# Altium schematic sheet Overvoltage_Protection.SchDoc: Overvoltage Protection
size A3; DocumentNumber: 7; SheetNumber: 7; SheetTotal: 20
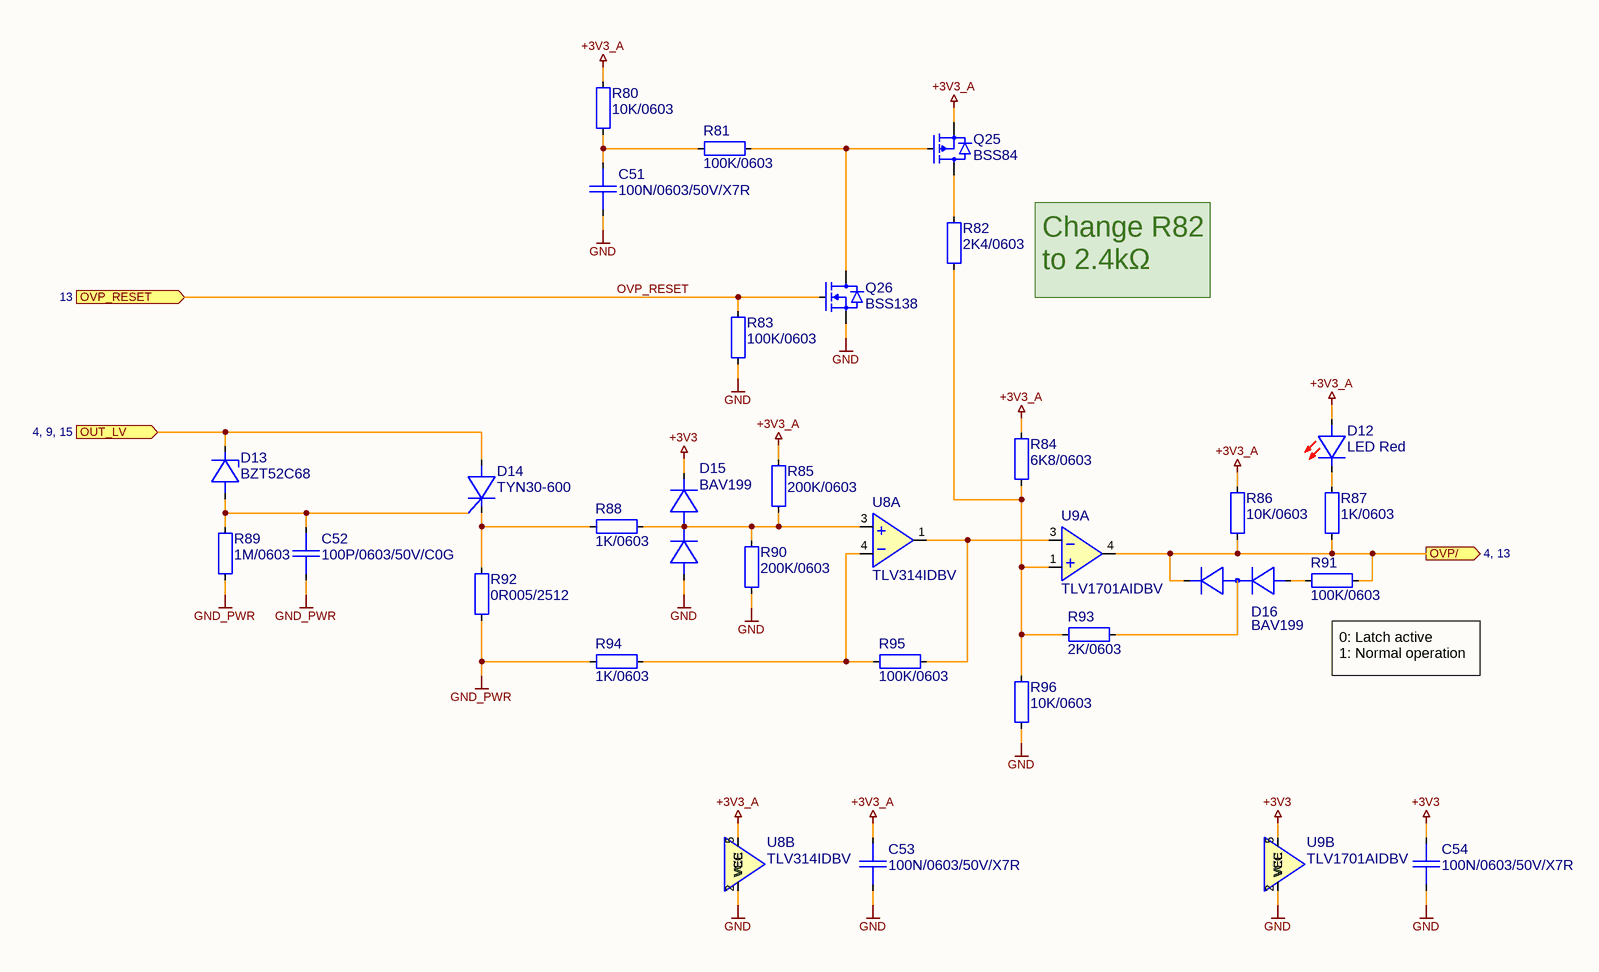
[diagram p0: Overvoltage_Protection.SchDoc]

## Parts
C51  100N/0603/50V/X7R  [CAP0603_X7R]
C52  100P/0603/50V/C0G  [CAP0603_C0G]
C53  100N/0603/50V/X7R  [CAP0603_X7R]
C54  100N/0603/50V/X7R  [CAP0603_X7R]
D12  LED Red  [LED0805_RED]
D13  BZT52C68  [SOD3718X125]
D14  TYN30-600  [TO220-3]
D15  BAV199  [SOT2395P280X125-3-SE]
D16  BAV199  [SOT2395P280X125-3-SE]
Q25  BSS84  [SOT2395P280X125-3-SE]
Q26  BSS138  [SOT2395P280X125-3-SE]
R80  10K/0603  [R0603-0.40-WW]
R81  100K/0603  [R0603-0.40-WW]
R82  2K4/0603  [R0603-0.40-WW]
R83  100K/0603  [R0603-0.40-WW]
R84  6K8/0603  [R0603-0.40-WW]
R85  200K/0603  [R0603-0.40-WW]
R86  10K/0603  [R0603-0.40-WW]
R87  1K/0603  [R0603-0.40-WW]
R88  1K/0603  [R0603-0.40-WW]
R89  1M/0603  [R0603-0.40-WW]
R90  200K/0603  [R0603-0.40-WW]
R91  100K/0603  [R0603-0.40-WW]
R92  0R005/2512  [R2512-0.65-WW]
R93  2K/0603  [R0603-0.40-WW]
R94  1K/0603  [R0603-0.40-WW]
R95  100K/0603  [R0603-0.40-WW]
R96  10K/0603  [R0603-0.40-WW]
U8  TLV314IDBV  [SOT2395P280X125-5-NW]  (parts A,B of 2)
U9  TLV1701AIDBV  [SOT2395P280X125-5-NW]  (parts A,B of 2)

## Ports
OUT_LV (in, see 4, 9, 15), OVP/ (out, see 4, 13), OVP_RESET (in, see 13)

## Nets
+3V3: C54.1 D15.2(K2) U9.5(VCC)
+3V3_A: C53.1 D12.2(A) Q25.2(SOURCE) R80.1 R84.1 R85.1 R86.2 U8.5(VCC)
GND: C51.2 C53.2 C54.2 D15.1(A1) Q26.2(SOURCE) R83.2 R90.2 R96.2 U8.2(VEE) U9.2(VEE)
GND_PWR: C52.2 R89.2 R92.2 R94.2
OUT_LV: D13.1(C) D14.2(A) ; port OUT_LV
OVP/: D16.2(K2) R86.1 R87.1 R91.2 U9.4(OUT) ; port OVP/
OVP_RESET: Q26.1(GATE) R83.1 ; port OVP_RESET
NetC51_1: C51.1 R80.2 R81.1
NetC52_1: C52.1 D13.2(A) D14.3(G) R89.1
NetD12_1: D12.1(C) R87.2
NetD14_1: D14.1(C) R88.1 R92.1
NetD15_3: D15.3(K1/A2) R85.2 R88.2 R90.1 U8.3(IN+)
NetD16_1: D16.1(A1) R91.1
NetD16_3: D16.3(K1/A2) R93.2
NetQ25_1: Q25.1(GATE) Q26.3(DRAIN) R81.2
NetQ25_3: Q25.3(DRAIN) R82.1
NetR82_2: R82.2 R84.2 R93.1 R96.1 U9.1(IN+)
NetR94_1: R94.1 R95.2 U8.4(IN-)
NetR95_1: R95.1 U8.1(OUT) U9.3(IN-)

## Notes on the sheet
- Change R82 to 2.4kΩ
- 0: Latch active
  1: Normal operation
- Date:
- Size:
- A3
- Schema:
- Layout:

## Library data of the parts
C51 C53 C54 = 100N/0603/50V/X7R: CAP SM 0603 100nF 50V X7R; Manufacturer: GENERIC; Manufacturer 1: YAGEO; Manufacturer Part Number 1: CC0603KPX7R9BB104; Absolute Value: 1E-7; Eurocircuits GPN: GPC0603104; Part Number: 100N/0603/50V/X7R; Package: 0603; Value: 100nF; HelpURL: https://www.yageo.com/upload/media/product/app/datasheet/mlcc/upy-gphc_x7r_6_3v-to-250v.pdf; Supplier 1: Digi-Key; Supplier Part Number 1: 311-3567-1-ND; Supplier 3: LCSC; Supplier Part Number 3: C14663; Manufacturer 2: YAGEO; Manufacturer Part Number 2: CC0603MRX7R9BB104; Supplier 2: Digi-Key; Supplier Part Number 2: 311-4110-1-ND; JLC Type: Basic; Manufacturer Part Number 3: CC0603KRX7R9BB104
C52 = 100P/0603/50V/C0G: CAP SM 0603 100pF 50V C0G; Manufacturer: GENERIC; Manufacturer 1: YAGEO; Manufacturer Part Number 1: CC0603JRNPO9BN101; Absolute Value: 1E-10; Eurocircuits GPN: GPC0603101-C0G; Part Number: 100P/0603/50V/C0G; Package: 0603; Value: 100pF; HelpURL: https://www.yageo.com/upload/media/product/productsearch/datasheet/mlcc/UPY-GP_NP0_16V-to-50V_18.pdf; Supplier 1: Digi-Key; Supplier Part Number 1: 311-1069-1-ND; Manufacturer 2: YAGEO; Manufacturer Part Number 2: CC0603KRNPO9BN101; Supplier 2: Digi-Key; Supplier Part Number 2: 311-3600-1-ND; JLC Type: Basic; Manufacturer Part Number 3: CL10C101JB8NNNC; Supplier 3: LCSC; Supplier Part Number 3: C14858
D12 = LED Red 0805: Generic LED Red 0805; Manufacturer 1: Würth; Manufacturer Part Number 1: 150080RS75000; Part Number: LED Red 0805; Manufacturer: GENERIC; Package: 805; Value: Red; Absolute Value: Red; HelpURL: https://www.we-online.com/katalog/datasheet/150060RS75000.pdf; Supplier 1: Digikey; Supplier Part Number 1: 732-4984-1-ND; Manufacturer 3: Foshan NationStar Optoelectronics; Manufacturer Part Number 3: NCD0805R1; Supplier 3: LCSC; Supplier Part Number 3: C84256; JLC Type: Basic
D13 = BZT52C68: DIODE ZENER 68V 350MW SOD123; Manufacturer: Nexperia USA Inc.; Manufacturer Part Number 1: BZT52-C68J; Part Number: BZT52C68; Package: SOD-123; Value: BZT52C68; Absolute Value: 68 V; HelpURL: https://assets.nexperia.com/documents/data-sheet/BZT52_SER.pdf; Manufacturer 1: Nexperia USA Inc.; Supplier 1: Digikey; Supplier Part Number 1: 1727-8144-1-ND; Manufacturer 2: Panjit International Inc.; Manufacturer Part Number 2: BZT52-C68_R1_00001; Supplier 2: Digikey; Supplier Part Number 2: 3757-BZT52-C68_R1_00001CT-ND; JLC Type: Extended; Manufacturer 3: JUXING; Manufacturer Part Number 3: BZT52C68V; Supplier 3: LCSC; Supplier Part Number 3: C5365518
D14 = TYN30-600: Planar passivated Silicon Controlled Rectifier (SCR) in a TO220 plastic package, 600V, 30A; Manufacturer: WeEn Semiconductors; Value: TYN30-600TFQ; Part Number: TYN30-600; Package: TO-220; HelpURL: https://www.ween-semi.com/datasheet/TYN30-600TF.pdf; Manufacturer 1: WeEn Semiconductors; Manufacturer Part Number 1: TYN30-600TFQ; Supplier 1: Digikey; Supplier Part Number 1: 1740-TYN30-600TFQ-ND
D15 D16 = BAV199: Silicon Low Leakage Diode 85V; Manufacturer: Infineon Technologies; Manufacturer Part Number 1: BAV199E6433HTMA1; Part Number: BAV199; Package: SOT23; Value: BAV199; Absolute Value: 85V; HelpURL: https://www.infineon.com/dgdl/bav199series.pdf?folderId=db3a30431400ef6801141c748874044e&fileId=db3a30431400ef6801141cba733104e5; Manufacturer 1: Infineon Technologies; Supplier 1: Digikey; Supplier Part Number 1: BAV199E6433HTMA1CT-ND; Manufacturer 3: LRC; Manufacturer Part Number 3: LBAV199LT1G; Supplier 3: LCSC; Supplier Part Number 3: C12740
Q25 = BSS84: 50V P-Channel MOSFET; Manufacturer: GENERIC; Manufacturer 1: Good-Ark Semiconductor; Part Number: BSS84; Package: SOT23; HelpURL: https://goodarksemi.com/docs/datasheets/mosfets/BSS84.pdf; Manufacturer Part Number 1: BSS84; Supplier 1: Digi-Key; Supplier Part Number 1: 4786-BSS84CT-ND; Manufacturer 3: Jiangsu Changjing Electronics Technology Co., Ltd.; Manufacturer Part Number 3: BSS84; Supplier 3: LCSC; Supplier Part Number 3: C114481; JLC Type: Extended; Manufacturer 2: LRC; Manufacturer Part Number 2: LBSS84LT1G; Supplier 2: LCSC; Supplier Part Number 2: C8492
Q26 = BSS138: N-Kanal 50 V 220mA (Ta) 350mW (Ta) Oberflächenmontage SOT-23; Manufacturer: GENERIC; Manufacturer 1: ANBON SEMICONDUCTOR (INT'L) LIMITED; Part Number: BSS138; Package: SOT23; HelpURL: https://mm.digikey.com/Volume0/opasdata/d220001/medias/docus/3037/BSS138.pdf; Manufacturer Part Number 1: BSS138; Supplier 1: Digi-Key; Supplier Part Number 1: 4530-BSS138CT-ND; Manufacturer 3: FOSAN; Manufacturer Part Number 3: BSS138; Supplier 3: LCSC; Supplier Part Number 3: C2926186; JLC Type: Extended; Manufacturer 2: FOSAN; Manufacturer Part Number 2: BSS138; Supplier 2: LCSC; Supplier Part Number 2: C2926186
R80 R86 R96 = 10K/0603: RES SM 0603 10K; Manufacturer: GENERIC; Manufacturer 1: YAGEO; Manufacturer Part Number 1: RC0603FR-1310KL; Absolute Value: 10000; Eurocircuits GPN: GPR060310K; Part Number: 10K/0603; Package: 0603; Value: 10K; HelpURL: https://www.yageogroup.com/content/datasheet/asset/file/PYU-RC_GROUP_51_ROHS_L; Supplier 1: Digi-Key; Supplier Part Number 1: 13-RC0603FR-1310KLCT-ND; Manufacturer 2: YAGEO; Manufacturer Part Number 2: RC0603FR-1010KL; Supplier 2: Digi-Key; Supplier Part Number 2: 13-RC0603FR-1010KLCT-ND; Manufacturer 3: UNI-ROYAL(Uniroyal Elec); Manufacturer Part Number 3: 0603WAF1002T5E; Supplier 3: LCSC; Supplier Part Number 3: C25804; JLC Type: Basic
R81 R83 R91 R95 = 100K/0603: RES SM 0603 100K; Manufacturer: GENERIC; Manufacturer 1: YAGEO; Manufacturer Part Number 1: RC0603FR-13100KL; Absolute Value: 100000; Eurocircuits GPN: GPR0603100K; Part Number: 100K/0603; Package: 0603; Value: 100K; HelpURL: https://www.yageogroup.com/content/datasheet/asset/file/PYU-RC_GROUP_51_ROHS_L; Supplier 1: Digi-Key; Supplier Part Number 1: 13-RC0603FR-13100KLCT-ND; Manufacturer 2: YAGEO; Manufacturer Part Number 2: RC0603FR-10100KL; Supplier 2: Digi-Key; Supplier Part Number 2: 13-RC0603FR-10100KLCT-ND; Manufacturer 3: UNI-ROYAL(Uniroyal Elec); Manufacturer Part Number 3: 0603WAF1003T5E; Supplier 3: LCSC; Supplier Part Number 3: C25803; JLC Type: Basic
R82 = 2K4/0603: RES SM 0603 2K4; Manufacturer: GENERIC; Manufacturer 1: YAGEO; Manufacturer Part Number 1: RC0603FR-132K4L; Absolute Value: 2400; Eurocircuits GPN: GPR06032K4; Part Number: 2K4/0603; Package: 0603; Value: 2K4; HelpURL: https://www.yageogroup.com/content/datasheet/asset/file/PYU-RC_GROUP_51_ROHS_L; Supplier 1: Digi-Key; Supplier Part Number 1: 13-RC0603FR-132K4LCT-ND; Manufacturer 2: YAGEO; Manufacturer Part Number 2: RC0603FR-102K4L; Supplier 2: Digi-Key; Supplier Part Number 2: 13-RC0603FR-102K4LCT-ND
R84 = 6K8/0603: RES SM 0603 6K8; Manufacturer: GENERIC; Manufacturer 1: YAGEO; Manufacturer Part Number 1: RC0603FR-136K8L; Absolute Value: 6800; Eurocircuits GPN: GPR06036K8; Part Number: 6K8/0603; Package: 0603; Value: 6K8; HelpURL: https://www.yageogroup.com/content/datasheet/asset/file/PYU-RC_GROUP_51_ROHS_L; Supplier 1: Digi-Key; Supplier Part Number 1: 13-RC0603FR-136K8LCT-ND; Manufacturer 2: YAGEO; Manufacturer Part Number 2: RC0603FR-106K8L; Supplier 2: Digi-Key; Supplier Part Number 2: 13-RC0603FR-106K8LCT-ND; JLC Type: Basic; Manufacturer 3: UNI-ROYAL; Manufacturer Part Number 3: 0603WAF6801T5E; Supplier 3: LCSC; Supplier Part Number 3: C23212
R85 R90 = 200K/0603: RES SM 0603 200K; Manufacturer: GENERIC; Manufacturer 1: YAGEO; Manufacturer Part Number 1: RC0603FR-13200KL; Absolute Value: 200000; Eurocircuits GPN: GPR0603200K; Part Number: 200K/0603; Package: 0603; Value: 200K; HelpURL: https://www.yageogroup.com/content/datasheet/asset/file/PYU-RC_GROUP_51_ROHS_L; Supplier 1: Digi-Key; Supplier Part Number 1: 13-RC0603FR-13200KLCT-ND; Manufacturer 2: YAGEO; Manufacturer Part Number 2: RC0603FR-10200KL; Supplier 2: Digi-Key; Supplier Part Number 2: 13-RC0603FR-10200KLCT-ND; JLC Type: Basic; Manufacturer 3: UNI-ROYAL(Uniroyal Elec); Manufacturer Part Number 3: 0603WAF2003T5E; Supplier 3: LCSC; Supplier Part Number 3: C25811
R87 R88 R94 = 1K/0603: RES SM 0603 1K; Manufacturer: GENERIC; Manufacturer 1: YAGEO; Manufacturer Part Number 1: RC0603FR-131KL; Absolute Value: 1000; Eurocircuits GPN: GPR06031K; Part Number: 1K/0603; Package: 0603; Value: 1K; HelpURL: https://www.yageogroup.com/content/datasheet/asset/file/PYU-RC_GROUP_51_ROHS_L; Supplier 1: Digi-Key; Supplier Part Number 1: 13-RC0603FR-131KLCT-ND; Manufacturer 2: YAGEO; Manufacturer Part Number 2: RC0603FR-101KL; Supplier 2: Digi-Key; Supplier Part Number 2: 13-RC0603FR-101KLCT-ND; Manufacturer 3: UNI-ROYAL(Uniroyal Elec); Manufacturer Part Number 3: 0603WAF1001T5E; Supplier 3: LCSC; Supplier Part Number 3: C21190; JLC Type: Basic
R89 = 1M/0603: RES SM 0603 1M; Manufacturer: GENERIC; Manufacturer 1: YAGEO; Manufacturer Part Number 1: RC0603FR-131ML; Absolute Value: 1000000; Eurocircuits GPN: GPR06031M; Part Number: 1M/0603; Package: 0603; Value: 1M; HelpURL: https://www.yageogroup.com/content/datasheet/asset/file/PYU-RC_GROUP_51_ROHS_L; Supplier 1: Digi-Key; Supplier Part Number 1: 13-RC0603FR-131MLCT-ND; Manufacturer 2: YAGEO; Manufacturer Part Number 2: RC0603FR-101ML; Supplier 2: Digi-Key; Supplier Part Number 2: 13-RC0603FR-101MLCT-ND; Manufacturer 3: UNI-ROYAL(Uniroyal Elec); Manufacturer Part Number 3: 0603WAF1004T5E; Supplier 3: LCSC; Supplier Part Number 3: C22935; JLC Type: Basic
R92 = 0R005/2512: RES SM 2512 0R005; Manufacturer: GENERIC; Manufacturer 1: Ohmite; Manufacturer Part Number 1: MCS3264R005FER; Absolute Value: 0.005; Part Number: 0R005/2512; Package: 2512; Value: 0R005; HelpURL: https://www.ohmite.com/assets/docs/res_mcs.pdf?r=false; Supplier 1: Digi-Key; Supplier Part Number 1: MCS3264R005FERCT-ND; Manufacturer 3: prosemi; Manufacturer Part Number 3: LMP25MF2P0R005; Supplier 3: LCSC; Supplier Part Number 3: C2937402
R93 = 2K/0603: RES SM 0603 2K; Manufacturer: GENERIC; Manufacturer 1: YAGEO; Manufacturer Part Number 1: RC0603FR-132KL; Absolute Value: 2000; Eurocircuits GPN: GPR06032K; Part Number: 2K/0603; Package: 0603; Value: 2K; HelpURL: https://www.yageogroup.com/content/datasheet/asset/file/PYU-RC_GROUP_51_ROHS_L; Supplier 1: Digi-Key; Supplier Part Number 1: 13-RC0603FR-132KLCT-ND; Manufacturer 2: YAGEO; Manufacturer Part Number 2: RC0603FR-102KL; Supplier 2: Digi-Key; Supplier Part Number 2: 13-RC0603FR-102KLCT-ND; Manufacturer 3: UNI-ROYAL(Uniroyal Elec); Manufacturer Part Number 3: 0603WAF2001T5E; Supplier 3: LCSC; Supplier Part Number 3: C22975; JLC Type: Basic
U8 = TLV314 SOT23: TLV314, 3-MHz, Low-Power, Internal EMI Filter, RRIO, Operational Amplifier; Manufacturer: Texas Instruments; Manufacturer Part Number 1: TLV314IDBVR; Part Number: TLV314 SOT23; Package: SOT23-5; HelpURL: https://www.ti.com/lit/ds/symlink/tlv4314.pdf; Manufacturer 1: Texas Instruments; Supplier 1: Digi-Key; Supplier Part Number 1: 296-46275-1-ND; Manufacturer 3: Texas Instruments; Manufacturer Part Number 3: TLV314IDBVR; Supplier 3: LCSC; Supplier Part Number 3: C133032; Manufacturer 2: Texas Instruments; Manufacturer Part Number 2: TLV314IDBVT; Supplier 2: Digi-Key; Supplier Part Number 2: 296-44110-2-ND
U9 = TLV1701 SOT23: TLV1701 2.2-V to 36-V, microPower Comparato; Manufacturer: Texas Instruments; Manufacturer Part Number 1: TLV1701AIDBVR; Part Number: TLV1701 SOT23; Package: SOT23-5; HelpURL: https://www.ti.com/lit/ds/symlink/tlv1701.pdf; Manufacturer 1: Texas Instruments; Supplier 1: Digi-Key; Supplier Part Number 1: 296-40599-1-ND; Manufacturer 2: Texas Instruments; Manufacturer Part Number 2: TLV1701QDBVRQ1; Supplier 2: Digi-Key; Supplier Part Number 2: 296-47458-1-ND; Manufacturer 3: Texas Instruments; Manufacturer Part Number 3: TLV1701AIDBVR; Supplier 3: LCSC; Supplier Part Number 3: C130035